# Altium schematic sheet MAGI'sSensor.SchDoc
size A4
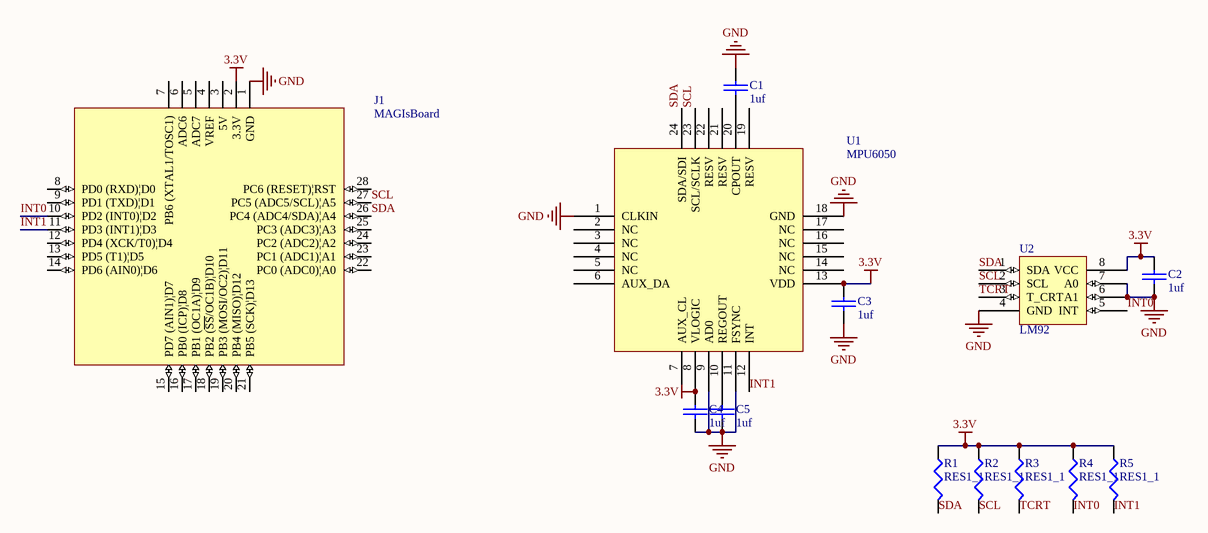
[diagram p0: MAGI'sSensor.SchDoc]

## Parts
C1  1uf  [6-0805_N]
C2  1uf  [6-0805_N]
C3  1uf  [6-0805_N]
C4  1uf  [6-0805_N]
C5  1uf  [6-0805_N]
J1  MAGIsBoard  [MAGIsBoard]
R1  RES1_1  [6-0805_N]
R2  RES1_1  [6-0805_N]
R3  RES1_1  [6-0805_N]
R4  RES1_1  [6-0805_N]
R5  RES1_1  [6-0805_N]
U1  MPU6050  [MPU6050]
U2  LM92  [8S1_N]

## Nets
3.3V: C2.2 C3.2 C4.2 J1.2(3.3V) R1.1 R2.1 R3.1 R4.1 R5.1 U1.8(VLOGIC) U1.13(VDD) U2.8(VCC)
GND: C1.1 C2.1 C3.1 C4.1 C5.1 J1.1(GND) U1.1(CLKIN) U1.9(AD0) U1.11(FSYNC) U1.18(GND) U2.4(GND) U2.6(A1) U2.7(A0)
INT0: J1.10(PD2_(INT0)|D2) R4.2 U2.5(INT)
INT1: J1.11(PD3_(INT1)|D3) R5.2 U1.12(INT)
SCL: J1.27(PC5_(ADC5/SCL)|A5) R2.2 U1.23(SCL/SCLK) U2.2(SCL)
SDA: J1.26(PC4_(ADC4/SDA)|A4) R1.2 U1.24(SDA/SDI) U2.1(SDA)
TCRT: R3.2 U2.3(T_CRT)
NetC1_2: C1.2 U1.20(CPOUT)
NetC5_2: C5.2 U1.10(REGOUT)

Not connected (* = marked no-connect by the designer): J1 3(5V) 4(VREF) 5(ADC7) 6(ADC6) 7(PB6_(XTAL1/TOSC1)) 8(PD0_(RXD)|D0) 9(PD1_(TXD)|D1) 12(PD4_(XCK/T0)|D4) 13(PD5_(T1)|D5) 14(PD6_(AIN0)|D6) 15(PD7_(AIN1)|D7) 16(PB0_(ICP)|D8) 17(PB1_(OC1A)|D9) 18(PB2_(~{SS}/OC1B)|D10) 19(PB3_(MOSI/OC2)|D11) 20(PB4_(MISO)|D12) 21(PB5_(SCK)|D13) 22(PC0_(ADC0)|A0) 23(PC1_(ADC1)|A1) 24(PC2_(ADC2)|A2) 25(PC3_(ADC3)|A3) 28(PC6_(RESET)|RST); U1 2(NC) 3(NC) 4(NC) 5(NC) 6(AUX_DA) 7(AUX_CL) 14(NC) 15(NC) 16(NC) 17(NC) 19(RESV) 21(RESV) 22(RESV)

## Library data of the parts
C1-C5 = CAP_1: Capacitor
U2 = ATtiny13A